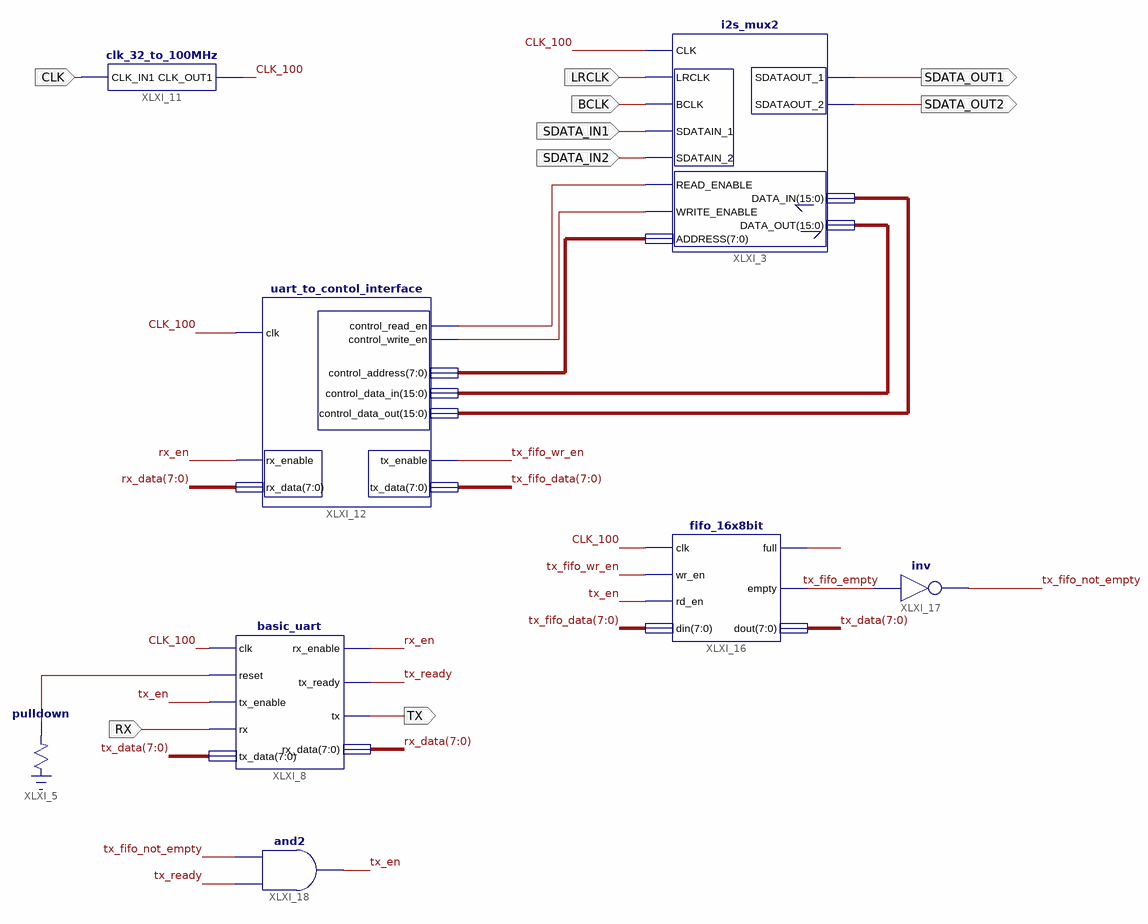
[diagram p0: schematic sheet 1]
// Xilinx ISE schematic i2s_mux_top.sch (spartan6) as structural Verilog: 8 symbols, 9 ports
module i2s_mux_top (
  input  RX,
  input  CLK,
  input  LRCLK,
  input  BCLK,
  input  SDATA_IN1,
  input  SDATA_IN2,
  output TX,
  output SDATA_OUT1,
  output SDATA_OUT2
);

  wire CLK_100, rx_en, tx_en, tx_fifo_empty, tx_fifo_not_empty, tx_fifo_wr_en, tx_ready, XLXN_27, XLXN_61,
       XLXN_64, XLXN_65;
  wire [7:0] rx_data, tx_data, tx_fifo_data, XLXN_66;
  wire [15:0] XLXN_72, XLXN_73;

  \pulldown  XLXI_5 (.O(XLXN_27));
  uart_to_contol_interface XLXI_12 (
    .clk(CLK_100), .tx_data(tx_fifo_data), .tx_enable(tx_fifo_wr_en), .rx_data(rx_data), .rx_enable(rx_en),
    .control_data_out(XLXN_72), .control_data_in(XLXN_73), .control_address(XLXN_66),
    .control_write_en(XLXN_65), .control_read_en(XLXN_64));
  basic_uart XLXI_8 (
    .clk(CLK_100), .reset(XLXN_27), .tx_enable(tx_en), .rx(RX), .tx_data(tx_data), .rx_enable(rx_en),
    .tx_ready(tx_ready), .tx(TX), .rx_data(rx_data));
  clk_32_to_100MHz XLXI_11 (.CLK_IN1(CLK), .CLK_OUT1(CLK_100));
  fifo_16x8bit XLXI_16 (
    .clk(CLK_100), .wr_en(tx_fifo_wr_en), .rd_en(tx_en), .din(tx_fifo_data), .full(XLXN_61),
    .empty(tx_fifo_empty), .dout(tx_data));
  not XLXI_17 (tx_fifo_not_empty, tx_fifo_empty);
  and XLXI_18 (tx_en, tx_ready, tx_fifo_not_empty);
  i2s_mux2 XLXI_3 (
    .LRCLK(LRCLK), .BCLK(BCLK), .SDATAIN_1(SDATA_IN1), .SDATAIN_2(SDATA_IN2), .READ_ENABLE(XLXN_64),
    .WRITE_ENABLE(XLXN_65), .ADDRESS(XLXN_66), .SDATAOUT_1(SDATA_OUT1), .SDATAOUT_2(SDATA_OUT2),
    .CLK(CLK_100), .DATA_OUT(XLXN_73), .DATA_IN(XLXN_72));
endmodule
